# EAGLE schematic loa_v2c (EAGLE 6.5.0)

## Sheet 1 of 7
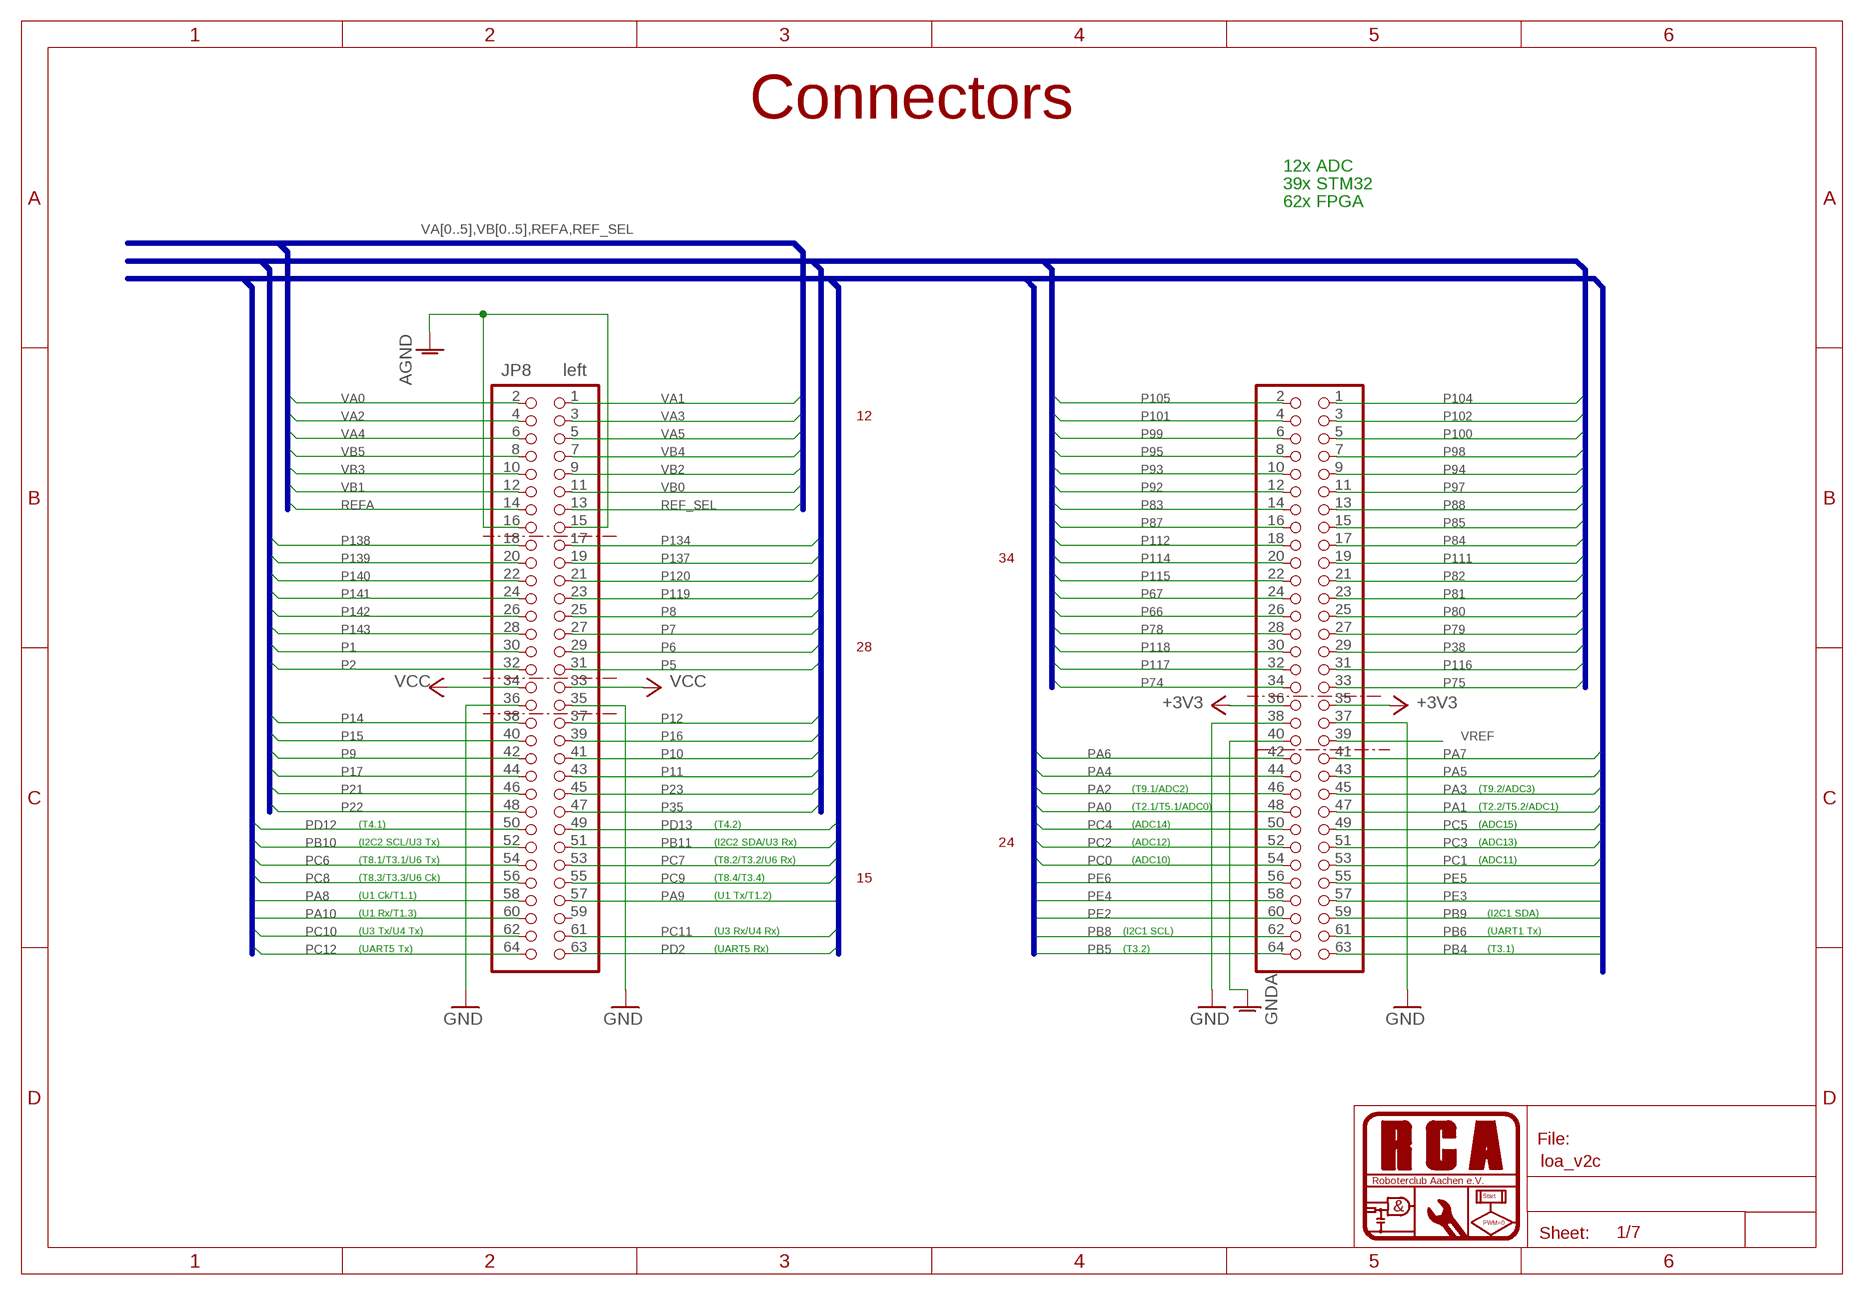
[diagram p0: schematic, sheet 1]

### Parts
JP7  right  PINHD-2X32_2.00-SMD  [2X32M_SMD]
JP8  left  PINHD-2X32_2.00-SMD  [2X32M_SMD]

### Nets
+3V3: JP7.35 JP7.36 ; also sheet 2,3,4,5,6,7
AGND: JP8.15 JP8.16 ; also sheet 4
GND: JP7.37 JP7.38 JP8.35 JP8.36 ; also sheet 2,3,4,5,6,7
GNDA: JP7.40 ; also sheet 7
P1: JP8.30 ; also sheet 3
P2: JP8.32 ; also sheet 3
P5: JP8.31 ; also sheet 3
P6: JP8.29 ; also sheet 3
P7: JP8.27 ; also sheet 3
P8: JP8.25 ; also sheet 3
P9: JP8.42 ; also sheet 3
P10: JP8.41 ; also sheet 3
P11: JP8.43 ; also sheet 3
P12: JP8.37 ; also sheet 3
P14: JP8.38 ; also sheet 3
P15: JP8.40 ; also sheet 3
P16: JP8.39 ; also sheet 3
P17: JP8.44 ; also sheet 3
P21: JP8.46 ; also sheet 3
P22: JP8.48 ; also sheet 3
P23: JP8.45 ; also sheet 3
P35: JP8.47 ; also sheet 3
P38: JP7.29 ; also sheet 3
P66: JP7.26 ; also sheet 3
P67: JP7.24 ; also sheet 3
P74: JP7.34 ; also sheet 3
P75: JP7.33 ; also sheet 3
P78: JP7.28 ; also sheet 3
P79: JP7.27 ; also sheet 3
P80: JP7.25 ; also sheet 3
P81: JP7.23 ; also sheet 3
P82: JP7.21 ; also sheet 3
P83: JP7.14 ; also sheet 3
P84: JP7.17 ; also sheet 3
P85: JP7.15 ; also sheet 3
P87: JP7.16 ; also sheet 3
P88: JP7.13 ; also sheet 3
P92: JP7.12 ; also sheet 3
P93: JP7.10 ; also sheet 3
P94: JP7.9 ; also sheet 3
P95: JP7.8 ; also sheet 3
P97: JP7.11 ; also sheet 3
P98: JP7.7 ; also sheet 3
P99: JP7.6 ; also sheet 3
P100: JP7.5 ; also sheet 3
P101: JP7.4 ; also sheet 3
P102: JP7.3 ; also sheet 3
P104: JP7.1 ; also sheet 3
P105: JP7.2 ; also sheet 3
P111: JP7.19 ; also sheet 3
P112: JP7.18 ; also sheet 3
P114: JP7.20 ; also sheet 3
P115: JP7.22 ; also sheet 3
P116: JP7.31 ; also sheet 3
P117: JP7.32 ; also sheet 3
P118: JP7.30 ; also sheet 3
P119: JP8.23 ; also sheet 3
P120: JP8.21 ; also sheet 3
P134: JP8.17 ; also sheet 3
P137: JP8.19 ; also sheet 3
P138: JP8.18 ; also sheet 3
P139: JP8.20 ; also sheet 3
P140: JP8.22 ; also sheet 3
P141: JP8.24 ; also sheet 3
P142: JP8.26 ; also sheet 3
P143: JP8.28 ; also sheet 3
PA0: JP7.48 ; also sheet 2
PA1: JP7.47 ; also sheet 2
PA2: JP7.46 ; also sheet 2
PA3: JP7.45 ; also sheet 2
PA4: JP7.44 ; also sheet 2
PA5: JP7.43 ; also sheet 2
PA6: JP7.42 ; also sheet 2
PA7: JP7.41 ; also sheet 2
PA8: JP8.58 ; also sheet 2
PA9: JP8.57 ; also sheet 2
PA10: JP8.60 ; also sheet 2
PB4: JP7.63 ; also sheet 2
PB5: JP7.64 ; also sheet 2
PB6: JP7.61 ; also sheet 2
PB8: JP7.62 ; also sheet 2
PB9: JP7.59 ; also sheet 2
PB10: JP8.52 ; also sheet 2
PB11: JP8.51 ; also sheet 2
PC0: JP7.54 ; also sheet 2
PC1: JP7.53 ; also sheet 2
PC2: JP7.52 ; also sheet 2
PC3: JP7.51 ; also sheet 2
PC4: JP7.50 ; also sheet 2
PC5: JP7.49 ; also sheet 2
PC6: JP8.54 ; also sheet 2
PC7: JP8.53 ; also sheet 2
PC8: JP8.56 ; also sheet 2
PC9: JP8.55 ; also sheet 2
PC10: JP8.62 ; also sheet 2
PC11: JP8.61 ; also sheet 2
PC12: JP8.64 ; also sheet 2
PD2: JP8.63 ; also sheet 2
PD12: JP8.50 ; also sheet 2
PD13: JP8.49 ; also sheet 2
PE2: JP7.60 ; also sheet 2
PE3: JP7.57 ; also sheet 2
PE4: JP7.58 ; also sheet 2
PE5: JP7.55 ; also sheet 2,5
PE6: JP7.56 ; also sheet 2,5
REF_SEL: JP8.13 ; also sheet 4
REFA: JP8.14 ; also sheet 4
VA0: JP8.2 ; also sheet 4
VA1: JP8.1 ; also sheet 4
VA2: JP8.4 ; also sheet 4
VA3: JP8.3 ; also sheet 4
VA4: JP8.6 ; also sheet 4
VA5: JP8.5 ; also sheet 4
VB0: JP8.11 ; also sheet 4
VB1: JP8.12 ; also sheet 4
VB2: JP8.9 ; also sheet 4
VB3: JP8.10 ; also sheet 4
VB4: JP8.7 ; also sheet 4
VB5: JP8.8 ; also sheet 4
VCC: JP8.33 JP8.34 ; also sheet 6
VREF: JP7.39 ; also sheet 7
Unconnected: JP8.59

### Buses
VA[0..5],VB[0..5],REFA,REF_SEL
P[1..2],P[5..12],P[14..17],P[21..24],P[26..27],P[29..30],P[32..35],P38,P66,P67,P74,P75,P[78..85],P87,P88,P[92..95],P[97..102],P104,P105,P[111..112],P[114..121],P[123..124],P[126..127],P[131..134],P[137..143]
PA[0..10],PB[0..2],PB[4..6],PB[8..11],PC[0..12],PD2,PD[12..13],PE[2..6]

### Notes on the sheet
- Connectors
- 12x ADC
- 39x STM32
- 62x FPGA
- 12
- 34
- 28
- (T9.1/ADC2) | (T9.2/ADC3)
- (T2.1/T5.1/ADC0) | (T2.2/T5.2/ADC1)
- (T4.1) | (T4.2) | (ADC14) | (ADC15)
- (I2C2 SCL/U3 Tx) | (I2C2 SDA/U3 Rx) | 24 | (ADC12) | (ADC13)
- (T8.1/T3.1/U6 Tx) | (T8.2/T3.2/U6 Rx) | (ADC10) | (ADC11)
- (T8.3/T3.3/U6 Ck) | (T8.4/T3.4) | 15
- (U1 Ck/T1.1) | (U1 Tx/T1.2)
- (U1 Rx/T1.3) | (I2C1 SDA)
- (U3 Tx/U4 Tx) | (U3 Rx/U4 Rx) | (I2C1 SCL) | (UART1 Tx)
- (UART5 Tx) | (UART5 Rx) | (T3.2) | (T3.1)

## Sheet 2 of 7
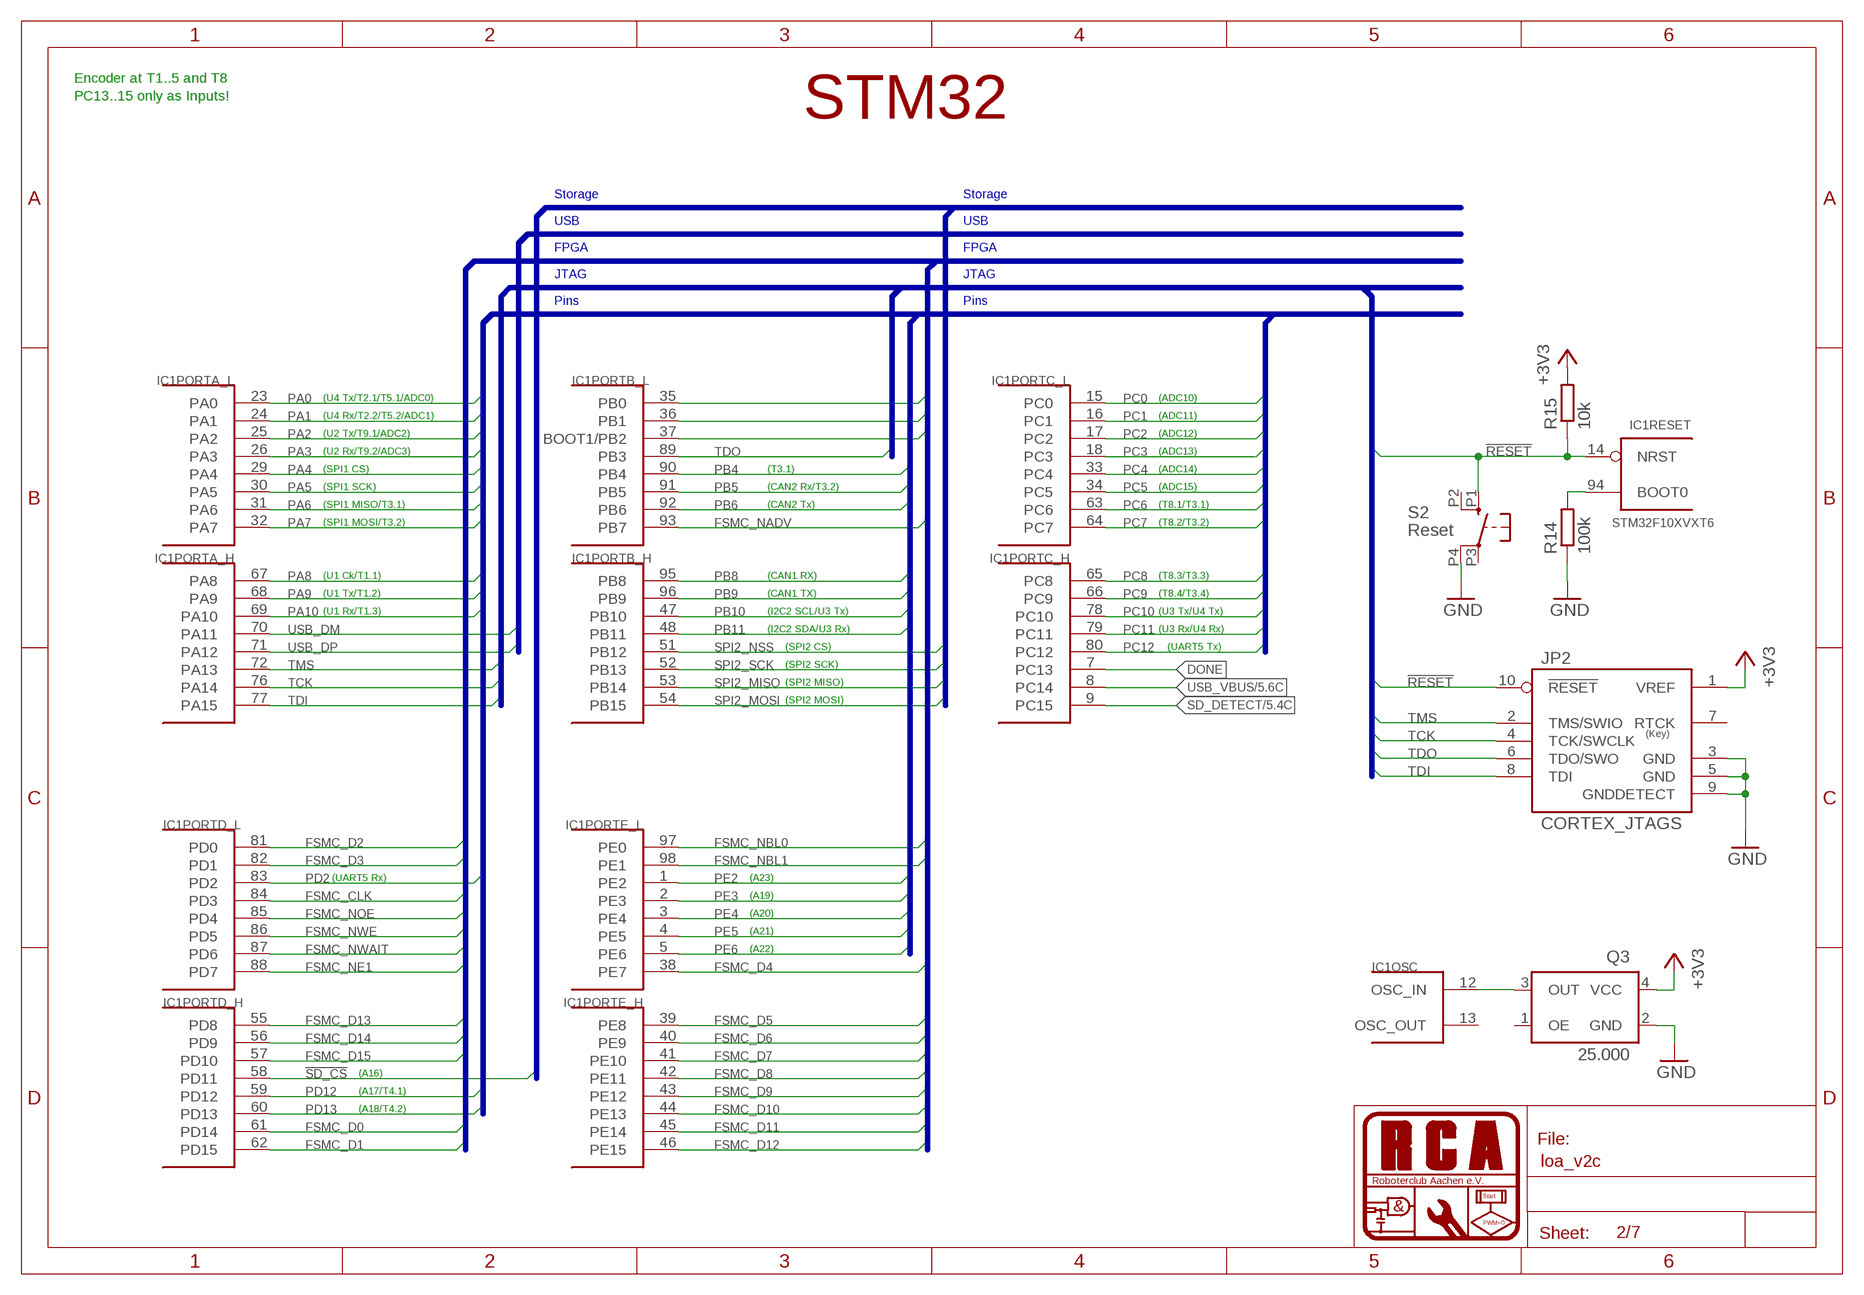
[diagram p1: schematic, sheet 2]

### Parts
IC1  STM32F10XVXT6  [TQFP100]
JP2  CORTEX_JTAGS  [2X05SMD]
Q3  25.000  XO53  [XO53]
R14  100k  R-EU_R0603  [R0603]
R15  10k  R-EU_R0603  [R0603]
S2  Reset  10-XXLSH  [B3F-10XX-SMD]

### Nets
!RESET: IC1.14(RESET:NRST) JP2.10(!RESET) R15.1 S2.P1(S)
!SD_CS: IC1.58(PORTD_H:PD11) ; also sheet 5
+3V3: JP2.1(VREF) Q3.4(VCC) R15.2 ; also sheet 1,3,4,5,6,7
CCLK: IC1.35(PORTB_L:PB0) ; also sheet 3
DONE: IC1.7(PORTC_H:PC13) ; also sheet 3
FSMC_CLK: IC1.84(PORTD_L:PD3) ; also sheet 3
FSMC_D0: IC1.61(PORTD_H:PD14) ; also sheet 3
FSMC_D1: IC1.62(PORTD_H:PD15) ; also sheet 3
FSMC_D2: IC1.81(PORTD_L:PD0) ; also sheet 3
FSMC_D3: IC1.82(PORTD_L:PD1) ; also sheet 3
FSMC_D4: IC1.38(PORTE_L:PE7) ; also sheet 3
FSMC_D5: IC1.39(PORTE_H:PE8) ; also sheet 3
FSMC_D6: IC1.40(PORTE_H:PE9) ; also sheet 3
FSMC_D7: IC1.41(PORTE_H:PE10) ; also sheet 3
FSMC_D8: IC1.42(PORTE_H:PE11) ; also sheet 3
FSMC_D9: IC1.43(PORTE_H:PE12) ; also sheet 3
FSMC_D10: IC1.44(PORTE_H:PE13) ; also sheet 3
FSMC_D11: IC1.45(PORTE_H:PE14) ; also sheet 3
FSMC_D12: IC1.46(PORTE_H:PE15) ; also sheet 3
FSMC_D13: IC1.55(PORTD_H:PD8) ; also sheet 3
FSMC_D14: IC1.56(PORTD_H:PD9) ; also sheet 3
FSMC_D15: IC1.57(PORTD_H:PD10) ; also sheet 3
FSMC_NADV: IC1.93(PORTB_L:PB7) ; also sheet 3
FSMC_NBL0: IC1.97(PORTE_L:PE0) ; also sheet 3
FSMC_NBL1: IC1.98(PORTE_L:PE1) ; also sheet 3
FSMC_NE1: IC1.88(PORTD_L:PD7) ; also sheet 3
FSMC_NOE: IC1.85(PORTD_L:PD4) ; also sheet 3
FSMC_NWAIT: IC1.87(PORTD_L:PD6) ; also sheet 3
FSMC_NWE: IC1.86(PORTD_L:PD5) ; also sheet 3
GND: JP2.3(GND) JP2.5(GND) JP2.9(GNDDETECT) Q3.2(GND) R14.1 S2.P4(P1) ; also sheet 1,3,4,5,6,7
INIT_B: IC1.36(PORTB_L:PB1) ; also sheet 3
N$41: IC1.94(RESET:BOOT0) R14.2
N$56: IC1.12(OSC:OSC_IN) Q3.3(OUT)
PA0: IC1.23(PORTA_L:PA0) ; also sheet 1
PA1: IC1.24(PORTA_L:PA1) ; also sheet 1
PA2: IC1.25(PORTA_L:PA2) ; also sheet 1
PA3: IC1.26(PORTA_L:PA3) ; also sheet 1
PA4: IC1.29(PORTA_L:PA4) ; also sheet 1
PA5: IC1.30(PORTA_L:PA5) ; also sheet 1
PA6: IC1.31(PORTA_L:PA6) ; also sheet 1
PA7: IC1.32(PORTA_L:PA7) ; also sheet 1
PA8: IC1.67(PORTA_H:PA8) ; also sheet 1
PA9: IC1.68(PORTA_H:PA9) ; also sheet 1
PA10: IC1.69(PORTA_H:PA10) ; also sheet 1
PB4: IC1.90(PORTB_L:PB4) ; also sheet 1
PB5: IC1.91(PORTB_L:PB5) ; also sheet 1
PB6: IC1.92(PORTB_L:PB6) ; also sheet 1
PB8: IC1.95(PORTB_H:PB8) ; also sheet 1
PB9: IC1.96(PORTB_H:PB9) ; also sheet 1
PB10: IC1.47(PORTB_H:PB10) ; also sheet 1
PB11: IC1.48(PORTB_H:PB11) ; also sheet 1
PC0: IC1.15(PORTC_L:PC0) ; also sheet 1
PC1: IC1.16(PORTC_L:PC1) ; also sheet 1
PC2: IC1.17(PORTC_L:PC2) ; also sheet 1
PC3: IC1.18(PORTC_L:PC3) ; also sheet 1
PC4: IC1.33(PORTC_L:PC4) ; also sheet 1
PC5: IC1.34(PORTC_L:PC5) ; also sheet 1
PC6: IC1.63(PORTC_L:PC6) ; also sheet 1
PC7: IC1.64(PORTC_L:PC7) ; also sheet 1
PC8: IC1.65(PORTC_H:PC8) ; also sheet 1
PC9: IC1.66(PORTC_H:PC9) ; also sheet 1
PC10: IC1.78(PORTC_H:PC10) ; also sheet 1
PC11: IC1.79(PORTC_H:PC11) ; also sheet 1
PC12: IC1.80(PORTC_H:PC12) ; also sheet 1
PD2: IC1.83(PORTD_L:PD2) ; also sheet 1
PD12: IC1.59(PORTD_H:PD12) ; also sheet 1
PD13: IC1.60(PORTD_H:PD13) ; also sheet 1
PE2: IC1.1(PORTE_L:PE2) ; also sheet 1
PE3: IC1.2(PORTE_L:PE3) ; also sheet 1
PE4: IC1.3(PORTE_L:PE4) ; also sheet 1
PE5: IC1.4(PORTE_L:PE5) ; also sheet 1,5
PE6: IC1.5(PORTE_L:PE6) ; also sheet 1,5
PROGRAM_B: IC1.37(PORTB_L:BOOT1/PB2) ; also sheet 3
SD_DETECT: IC1.9(PORTC_H:PC15) ; also sheet 5
SPI2_MISO: IC1.53(PORTB_H:PB14) ; also sheet 5
SPI2_MOSI: IC1.54(PORTB_H:PB15) ; also sheet 5
SPI2_NSS: IC1.51(PORTB_H:PB12) ; also sheet 5
SPI2_SCK: IC1.52(PORTB_H:PB13) ; also sheet 5
TCK: IC1.76(PORTA_H:PA14) JP2.4(TCK/SWCLK)
TDI: IC1.77(PORTA_H:PA15) JP2.8(TDI)
TDO: IC1.89(PORTB_L:PB3) JP2.6(TDO/SWO)
TMS: IC1.72(PORTA_H:PA13) JP2.2(TMS/SWIO)
USB_DM: IC1.70(PORTA_H:PA11) ; also sheet 5
USB_DP: IC1.71(PORTA_H:PA12) ; also sheet 5
USB_VBUS: IC1.8(PORTC_H:PC14) ; also sheet 5,6
Unconnected: IC1.13(OSC:OSC_OUT) JP2.7(RTCK) Q3.1(OE) S2.P2(S1) S2.P3(P)

### Buses
JTAG:!RESET,TRST,TMS,TCK,TDO,TDI
USB:USB_VBUS,USB_DM,USB_DP
PA[0..10],PB[0..2],PB[4..6],PB[8..11],PC[0..12],PD2,PD[12..13],PE[2..6]
FPGA:FSMC_D[0..15],FSMC_NADV,FSMC_CLK,FSMC_NOE,FSMC_NWE,FSMC_NWAIT,FSMC_NE1,FSMC_NBL0,FSMC_NBL1,PROGRAM_B,INIT_B,DONE,CCLK
STORAGE:SPI2_NSS,SPI2_SCK,SPI2_MOSI,SPI2_MISO,SD_DETECT,!SD_CS

### Notes on the sheet
- Encoder at T1..5 and T8
- PC13..15 only as Inputs!
- STM32
- Storage | Storage
- USB | USB
- FPGA | FPGA
- JTAG | JTAG
- Pins | Pins
- (U4 Tx/T2.1/T5.1/ADC0) | (ADC10)
- (U4 Rx/T2.2/T5.2/ADC1) | (ADC11)
- (U2 Tx/T9.1/ADC2) | (ADC12)
- (U2 Rx/T9.2/ADC3) | (ADC13)
- (SPI1 CS) | (T3.1) | (ADC14)
- (SPI1 SCK) | (CAN2 Rx/T3.2) | (ADC15)
- (SPI1 MISO/T3.1) | (CAN2 Tx) | (T8.1/T3.1)
- (SPI1 MOSI/T3.2) | (T8.2/T3.2)
- (U1 Ck/T1.1) | (CAN1 RX) | (T8.3/T3.3)
- (U1 Tx/T1.2) | (CAN1 TX) | (T8.4/T3.4)
- (U1 Rx/T1.3) | (I2C2 SCL/U3 Tx) | (U3 Tx/U4 Tx)
- (I2C2 SDA/U3 Rx) | (U3 Rx/U4 Rx)
- (SPI2 CS) | (UART5 Tx)
- (SPI2 SCK)
- (SPI2 MISO)
- (SPI2 MOSI)
- (UART5 Rx) | (A23)
- (A19)
- (A20)
- (A21)
- (A22)
- (A16)
- (A17/T4.1)
- (A18/T4.2)

## Sheet 3 of 7
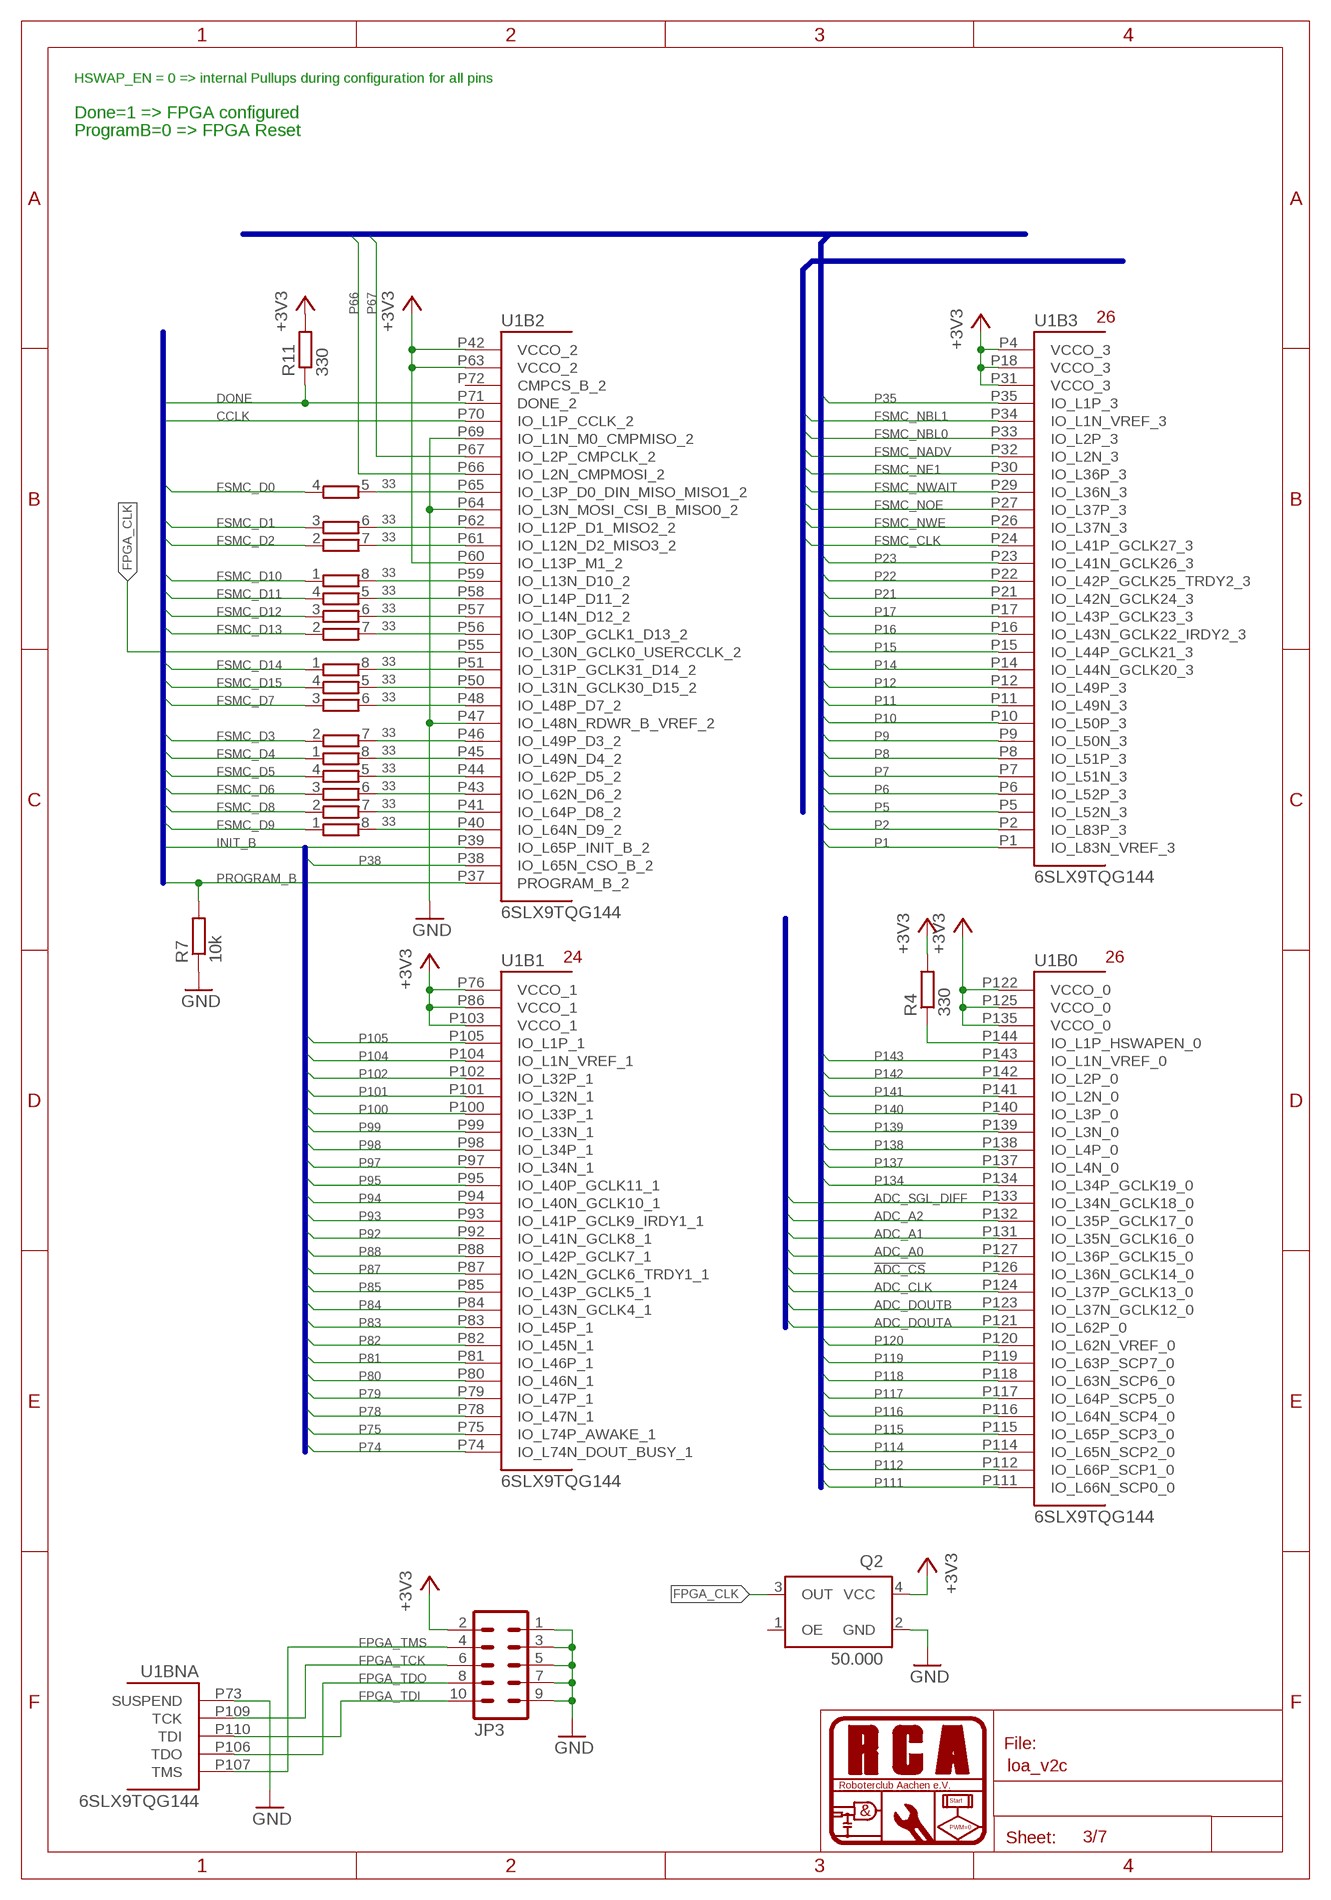
[diagram p2: schematic, sheet 3]

### Parts
JP3  ML10S  [ML10S]
Q2  50.000  XO53  [XO53]
R4  330  R-EU_R0603  [R0603]
R7  10k  R-EU_R0603  [R0603]
R11  330  R-EU_R0603  [R0603]
RN3  33  4R-NEXB38V  [EXB38V]
RN4  33  4R-NEXB38V  [EXB38V]
RN6  33  4R-NEXB38V  [EXB38V]
RN7  33  4R-NEXB38V  [EXB38V]
U1  6SLX9TQG144  [TQ144]

### Nets
!ADC_CS: U1.P126(B0:IO_L36N_GCLK14_0) ; also sheet 4
+3V3: JP3.2 Q2.4(VCC) R4.2 R11.2 U1.P4(B3:VCCO_3) U1.P18(B3:VCCO_3) U1.P31(B3:VCCO_3) U1.P42(B2:VCCO_2) U1.P60(B2:IO_L13P_M1_2) U1.P63(B2:VCCO_2) U1.P76(B1:VCCO_1) U1.P86(B1:VCCO_1) U1.P103(B1:VCCO_1) U1.P122(B0:VCCO_0) U1.P125(B0:VCCO_0) U1.P135(B0:VCCO_0) ; also sheet 1,2,4,5,6,7
ADC_A0: U1.P127(B0:IO_L36P_GCLK15_0) ; also sheet 4
ADC_A1: U1.P131(B0:IO_L35N_GCLK16_0) ; also sheet 4
ADC_A2: U1.P132(B0:IO_L35P_GCLK17_0) ; also sheet 4
ADC_CLK: U1.P124(B0:IO_L37P_GCLK13_0) ; also sheet 4
ADC_DOUTA: U1.P121(B0:IO_L62P_0) ; also sheet 4
ADC_DOUTB: U1.P123(B0:IO_L37N_GCLK12_0) ; also sheet 4
ADC_SGL_DIFF: U1.P133(B0:IO_L34N_GCLK18_0) ; also sheet 4
CCLK: U1.P70(B2:IO_L1P_CCLK_2) ; also sheet 2
DONE: R11.1 U1.P71(B2:DONE_2) ; also sheet 2
FPGA_CLK: Q2.3(OUT) U1.P55(B2:IO_L30N_GCLK0_USERCCLK_2)
FPGA_TCK: JP3.6 U1.P109(BNA:TCK)
FPGA_TDI: JP3.10 U1.P110(BNA:TDI)
FPGA_TDO: JP3.8 U1.P106(BNA:TDO)
FPGA_TMS: JP3.4 U1.P107(BNA:TMS)
FSMC_CLK: U1.P24(B3:IO_L41P_GCLK27_3) ; also sheet 2
FSMC_D0: RN3.4 ; also sheet 2
FSMC_D1: RN3.3 ; also sheet 2
FSMC_D2: RN3.2 ; also sheet 2
FSMC_D3: RN7.2 ; also sheet 2
FSMC_D4: RN7.1 ; also sheet 2
FSMC_D5: RN4.4 ; also sheet 2
FSMC_D6: RN4.3 ; also sheet 2
FSMC_D7: RN7.3 ; also sheet 2
FSMC_D8: RN4.2 ; also sheet 2
FSMC_D9: RN4.1 ; also sheet 2
FSMC_D10: RN3.1 ; also sheet 2
FSMC_D11: RN6.4 ; also sheet 2
FSMC_D12: RN6.3 ; also sheet 2
FSMC_D13: RN6.2 ; also sheet 2
FSMC_D14: RN6.1 ; also sheet 2
FSMC_D15: RN7.4 ; also sheet 2
FSMC_NADV: U1.P32(B3:IO_L2N_3) ; also sheet 2
FSMC_NBL0: U1.P33(B3:IO_L2P_3) ; also sheet 2
FSMC_NBL1: U1.P34(B3:IO_L1N_VREF_3) ; also sheet 2
FSMC_NE1: U1.P30(B3:IO_L36P_3) ; also sheet 2
FSMC_NOE: U1.P27(B3:IO_L37P_3) ; also sheet 2
FSMC_NWAIT: U1.P29(B3:IO_L36N_3) ; also sheet 2
FSMC_NWE: U1.P26(B3:IO_L37N_3) ; also sheet 2
GND: JP3.1 JP3.3 JP3.5 JP3.7 JP3.9 Q2.2(GND) R7.1 U1.P47(B2:IO_L48N_RDWR_B_VREF_2) U1.P64(B2:IO_L3N_MOSI_CSI_B_MISO0_2) U1.P69(B2:IO_L1N_M0_CMPMISO_2) U1.P73(BNA:SUSPEND) ; also sheet 1,2,4,5,6,7
INIT_B: U1.P39(B2:IO_L65P_INIT_B_2) ; also sheet 2
N$2: RN3.5 U1.P65(B2:IO_L3P_D0_DIN_MISO_MISO1_2)
N$3: RN3.6 U1.P62(B2:IO_L12P_D1_MISO2_2)
N$5: RN3.7 U1.P61(B2:IO_L12N_D2_MISO3_2)
N$6: RN3.8 U1.P59(B2:IO_L13N_D10_2)
N$7: RN6.5 U1.P58(B2:IO_L14P_D11_2)
N$8: RN6.6 U1.P57(B2:IO_L14N_D12_2)
N$9: RN6.7 U1.P56(B2:IO_L30P_GCLK1_D13_2)
N$10: RN6.8 U1.P51(B2:IO_L31P_GCLK31_D14_2)
N$11: RN7.5 U1.P50(B2:IO_L31N_GCLK30_D15_2)
N$12: RN7.6 U1.P48(B2:IO_L48P_D7_2)
N$13: RN7.7 U1.P46(B2:IO_L49P_D3_2)
N$14: RN7.8 U1.P45(B2:IO_L49N_D4_2)
N$15: RN4.5 U1.P44(B2:IO_L62P_D5_2)
N$20: R4.1 U1.P144(B0:IO_L1P_HSWAPEN_0)
N$35: RN4.7 U1.P41(B2:IO_L64P_D8_2)
N$44: RN4.6 U1.P43(B2:IO_L62N_D6_2)
N$45: RN4.8 U1.P40(B2:IO_L64N_D9_2)
P1: U1.P1(B3:IO_L83N_VREF_3) ; also sheet 1
P2: U1.P2(B3:IO_L83P_3) ; also sheet 1
P5: U1.P5(B3:IO_L52N_3) ; also sheet 1
P6: U1.P6(B3:IO_L52P_3) ; also sheet 1
P7: U1.P7(B3:IO_L51N_3) ; also sheet 1
P8: U1.P8(B3:IO_L51P_3) ; also sheet 1
P9: U1.P9(B3:IO_L50N_3) ; also sheet 1
P10: U1.P10(B3:IO_L50P_3) ; also sheet 1
P11: U1.P11(B3:IO_L49N_3) ; also sheet 1
P12: U1.P12(B3:IO_L49P_3) ; also sheet 1
P14: U1.P14(B3:IO_L44N_GCLK20_3) ; also sheet 1
P15: U1.P15(B3:IO_L44P_GCLK21_3) ; also sheet 1
P16: U1.P16(B3:IO_L43N_GCLK22_IRDY2_3) ; also sheet 1
P17: U1.P17(B3:IO_L43P_GCLK23_3) ; also sheet 1
P21: U1.P21(B3:IO_L42N_GCLK24_3) ; also sheet 1
P22: U1.P22(B3:IO_L42P_GCLK25_TRDY2_3) ; also sheet 1
P23: U1.P23(B3:IO_L41N_GCLK26_3) ; also sheet 1
P35: U1.P35(B3:IO_L1P_3) ; also sheet 1
P38: U1.P38(B2:IO_L65N_CSO_B_2) ; also sheet 1
P66: U1.P66(B2:IO_L2N_CMPMOSI_2) ; also sheet 1
P67: U1.P67(B2:IO_L2P_CMPCLK_2) ; also sheet 1
P74: U1.P74(B1:IO_L74N_DOUT_BUSY_1) ; also sheet 1
P75: U1.P75(B1:IO_L74P_AWAKE_1) ; also sheet 1
P78: U1.P78(B1:IO_L47N_1) ; also sheet 1
P79: U1.P79(B1:IO_L47P_1) ; also sheet 1
P80: U1.P80(B1:IO_L46N_1) ; also sheet 1
P81: U1.P81(B1:IO_L46P_1) ; also sheet 1
P82: U1.P82(B1:IO_L45N_1) ; also sheet 1
P83: U1.P83(B1:IO_L45P_1) ; also sheet 1
P84: U1.P84(B1:IO_L43N_GCLK4_1) ; also sheet 1
P85: U1.P85(B1:IO_L43P_GCLK5_1) ; also sheet 1
P87: U1.P87(B1:IO_L42N_GCLK6_TRDY1_1) ; also sheet 1
P88: U1.P88(B1:IO_L42P_GCLK7_1) ; also sheet 1
P92: U1.P92(B1:IO_L41N_GCLK8_1) ; also sheet 1
P93: U1.P93(B1:IO_L41P_GCLK9_IRDY1_1) ; also sheet 1
P94: U1.P94(B1:IO_L40N_GCLK10_1) ; also sheet 1
P95: U1.P95(B1:IO_L40P_GCLK11_1) ; also sheet 1
P97: U1.P97(B1:IO_L34N_1) ; also sheet 1
P98: U1.P98(B1:IO_L34P_1) ; also sheet 1
P99: U1.P99(B1:IO_L33N_1) ; also sheet 1
P100: U1.P100(B1:IO_L33P_1) ; also sheet 1
P101: U1.P101(B1:IO_L32N_1) ; also sheet 1
P102: U1.P102(B1:IO_L32P_1) ; also sheet 1
P104: U1.P104(B1:IO_L1N_VREF_1) ; also sheet 1
P105: U1.P105(B1:IO_L1P_1) ; also sheet 1
P111: U1.P111(B0:IO_L66N_SCP0_0) ; also sheet 1
P112: U1.P112(B0:IO_L66P_SCP1_0) ; also sheet 1
P114: U1.P114(B0:IO_L65N_SCP2_0) ; also sheet 1
P115: U1.P115(B0:IO_L65P_SCP3_0) ; also sheet 1
P116: U1.P116(B0:IO_L64N_SCP4_0) ; also sheet 1
P117: U1.P117(B0:IO_L64P_SCP5_0) ; also sheet 1
P118: U1.P118(B0:IO_L63N_SCP6_0) ; also sheet 1
P119: U1.P119(B0:IO_L63P_SCP7_0) ; also sheet 1
P120: U1.P120(B0:IO_L62N_VREF_0) ; also sheet 1
P134: U1.P134(B0:IO_L34P_GCLK19_0) ; also sheet 1
P137: U1.P137(B0:IO_L4N_0) ; also sheet 1
P138: U1.P138(B0:IO_L4P_0) ; also sheet 1
P139: U1.P139(B0:IO_L3N_0) ; also sheet 1
P140: U1.P140(B0:IO_L3P_0) ; also sheet 1
P141: U1.P141(B0:IO_L2N_0) ; also sheet 1
P142: U1.P142(B0:IO_L2P_0) ; also sheet 1
P143: U1.P143(B0:IO_L1N_VREF_0) ; also sheet 1
PROGRAM_B: R7.2 U1.P37(B2:PROGRAM_B_2) ; also sheet 2
Unconnected: Q2.1(OE) U1.P72(B2:CMPCS_B_2)

### Buses
FPGA:FSMC_D[0..15],FSMC_NADV,FSMC_CLK,FSMC_NOE,FSMC_NWE,FSMC_NWAIT,FSMC_NE1,FSMC_NBL0,FSMC_NBL1,PROGRAM_B,INIT_B,DONE,CCLK
ADC:!ADC_CS,ADC_CLK,ADC_DOUTA,ADC_DOUTB,ADC_A[0..2],ADC_SGL_DIFF
P[1..2],P[5..12],P[14..17],P[21..24],P[26..27],P[29..30],P[32..35],P38,P66,P67,P74,P75,P[78..85],P87,P88,P[92..95],P[97..102],P104,P105,P[111..112],P[114..121],P[123..124],P[126..127],P[131..134],P[137..143]

### Notes on the sheet
- HSWAP_EN = 0 => internal Pullups during configuration for all pins
- Done=1 => FPGA configured
- ProgramB=0 => FPGA Reset
- 26
- 24 | 26

## Sheet 4 of 7
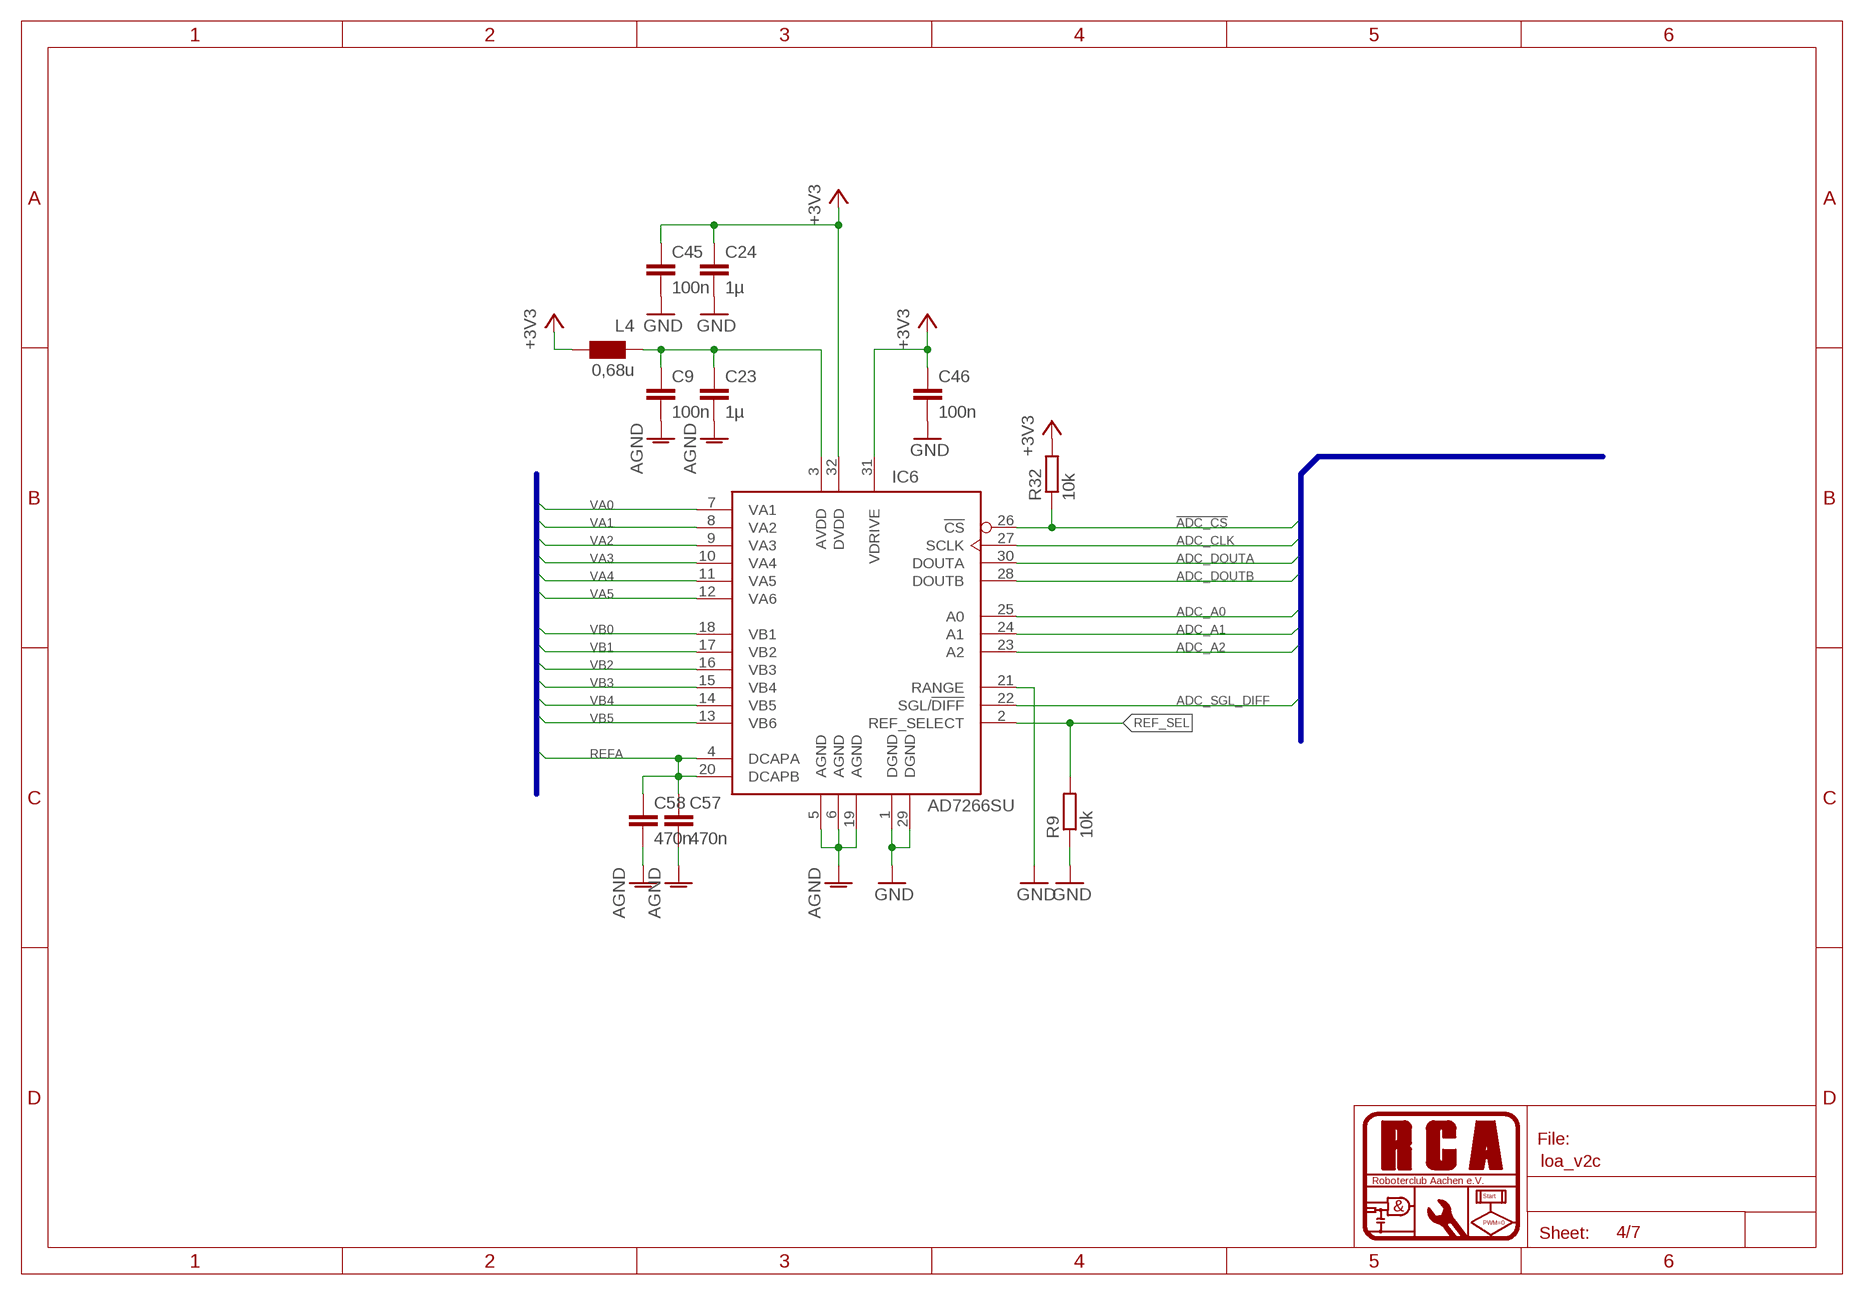
[diagram p3: schematic, sheet 4]

### Parts
C9  100n  C-EUC0603  [C0603]
C23  1µ  C-EUC0805  [C0805]
C24  1µ  C-EUC0805  [C0805]
C45  100n  C-EUC0603  [C0603]
C46  100n  C-EUC0603  [C0603]
C57  470n  C-EUC0805  [C0805]
C58  470n  C-EUC0805  [C0805]
IC6  AD7266SU  [TQFP32-08]
L4  0,68u  WE-KIHQ_0805  [WE-KI_0805_B]
R9  10k  R-EU_R0603  [R0603]
R32  10k  R-EU_R0603  [R0603]

### Nets
!ADC_CS: IC6.26(!CS) R32.1 ; also sheet 3
+3V3: C24.1 C45.1 C46.1 IC6.31(VDRIVE) IC6.32(DVDD) L4.1 R32.2 ; also sheet 1,2,3,5,6,7
ADC_A0: IC6.25(A0) ; also sheet 3
ADC_A1: IC6.24(A1) ; also sheet 3
ADC_A2: IC6.23(A2) ; also sheet 3
ADC_CLK: IC6.27(SCLK) ; also sheet 3
ADC_DOUTA: IC6.30(DOUTA) ; also sheet 3
ADC_DOUTB: IC6.28(DOUTB) ; also sheet 3
ADC_SGL_DIFF: IC6.22(SGL/!DIFF) ; also sheet 3
AGND: C9.2 C23.2 C57.2 C58.2 IC6.5(AGND) IC6.6(AGND) IC6.19(AGND) ; also sheet 1
GND: C24.2 C45.2 C46.2 IC6.1(DGND) IC6.21(RANGE) IC6.29(DGND) R9.1 ; also sheet 1,2,3,5,6,7
N$55: C9.1 C23.1 IC6.3(AVDD) L4.2
REF_SEL: IC6.2(REF_SELECT) R9.2 ; also sheet 1
REFA: C57.1 C58.1 IC6.4(DCAPA) IC6.20(DCAPB) ; also sheet 1
VA0: IC6.7(VA1) ; also sheet 1
VA1: IC6.8(VA2) ; also sheet 1
VA2: IC6.9(VA3) ; also sheet 1
VA3: IC6.10(VA4) ; also sheet 1
VA4: IC6.11(VA5) ; also sheet 1
VA5: IC6.12(VA6) ; also sheet 1
VB0: IC6.18(VB1) ; also sheet 1
VB1: IC6.17(VB2) ; also sheet 1
VB2: IC6.16(VB3) ; also sheet 1
VB3: IC6.15(VB4) ; also sheet 1
VB4: IC6.14(VB5) ; also sheet 1
VB5: IC6.13(VB6) ; also sheet 1

### Buses
VA[0..5],VB[0..5],REFA,REF_SEL
ADC:!ADC_CS,ADC_CLK,ADC_DOUTA,ADC_DOUTB,ADC_A[0..2],ADC_SGL_DIFF

## Sheet 5 of 7
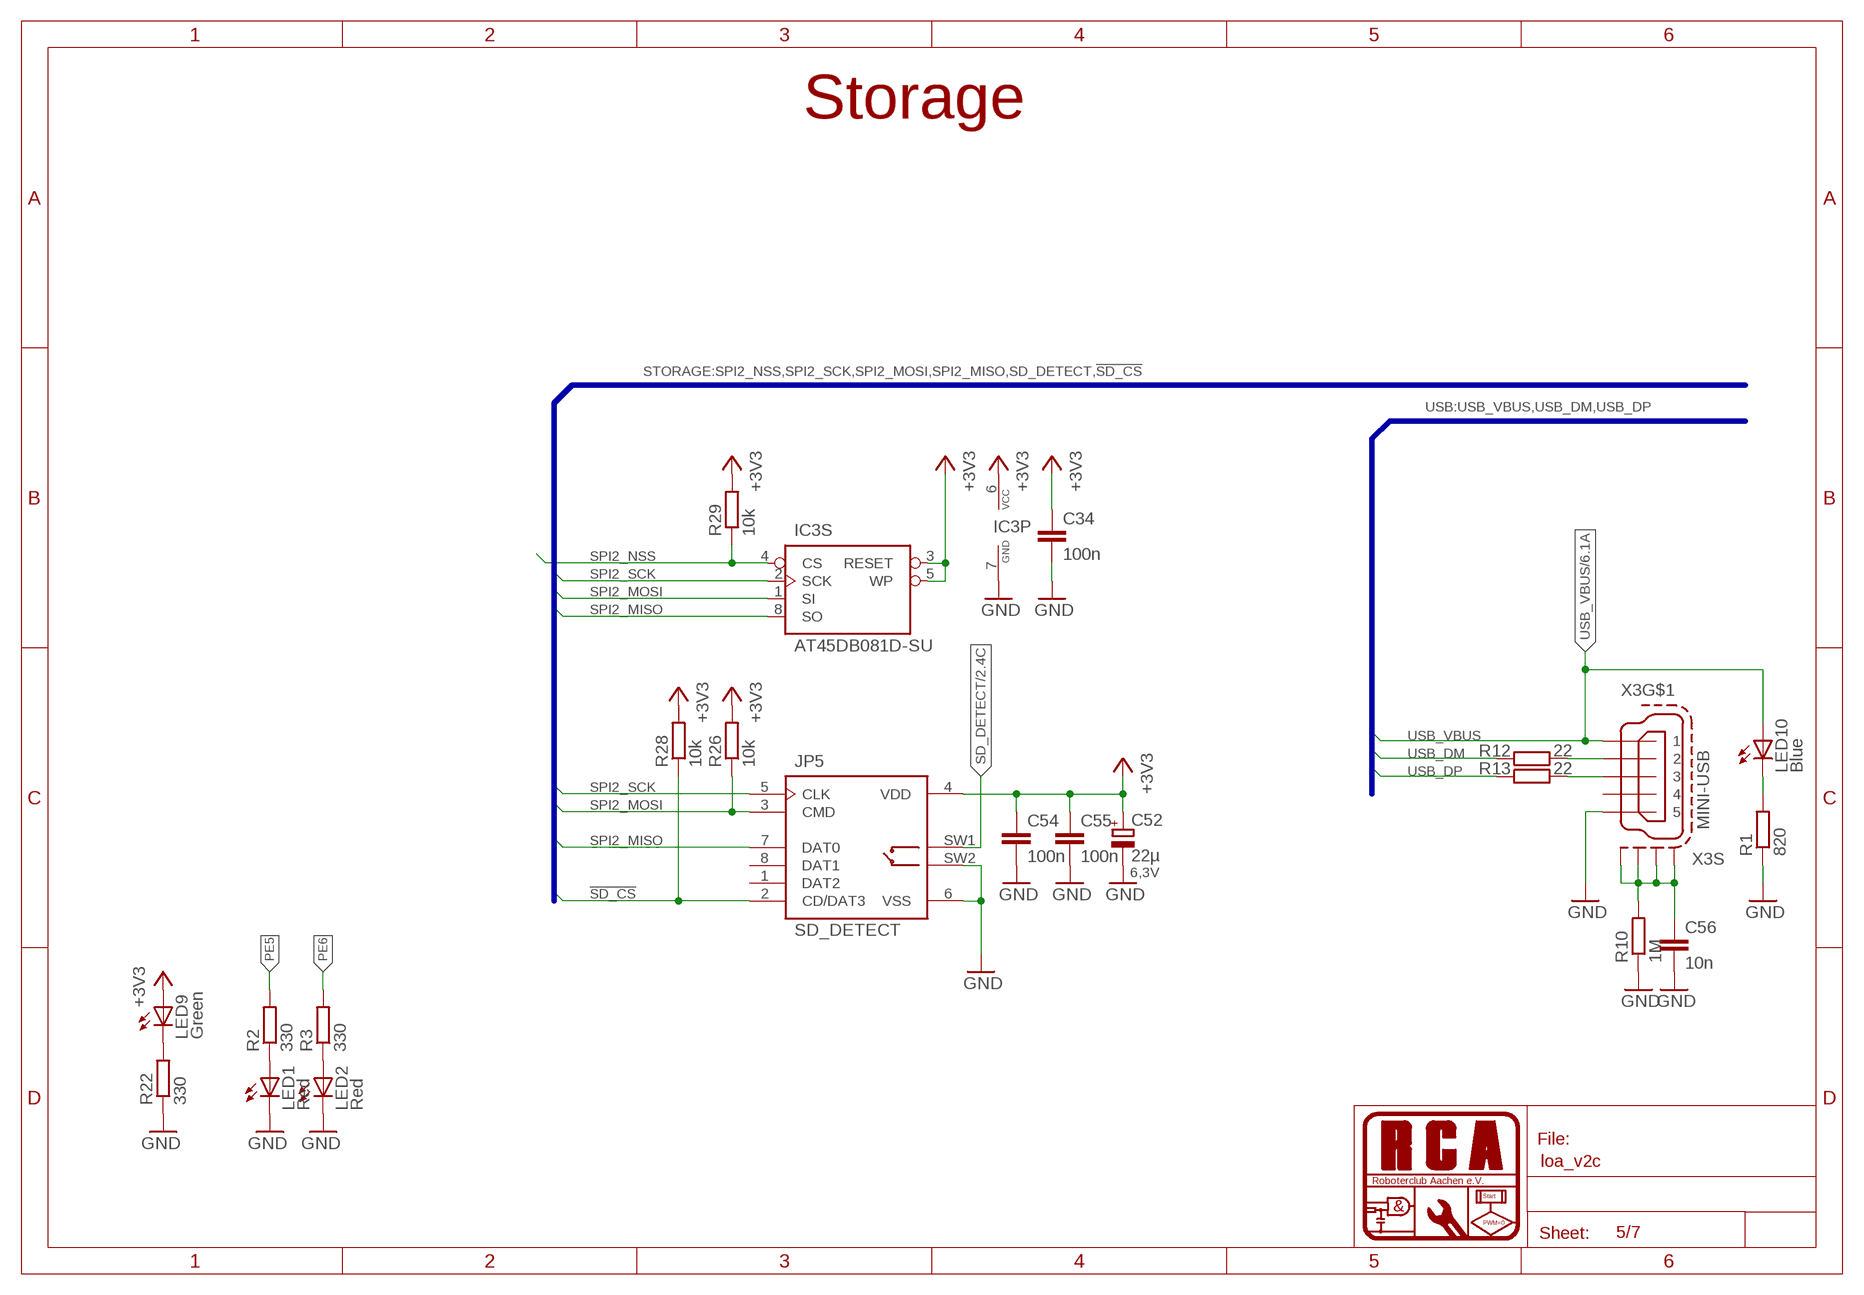
[diagram p4: schematic, sheet 5]

### Parts
C34  100n  C-EUC0603  [C0603]
C52  22µ  CPOL-EUSMCC  [SMC_C]
C54  100n  C-EUC0603  [C0603]
C55  100n  C-EUC0603  [C0603]
C56  10n  C-EUC0603  [C0603]
IC3  AT45DB081D-SU  AT45DB041DSS  [SO08]
JP5  SD_DETECT  [SD_MOLEX_49225-0821]
LED1  Red  LEDCHIPLED_0805  [CHIPLED_0805]
LED2  Red  LEDCHIPLED_0805  [CHIPLED_0805]
LED9  Green  LEDCHIPLED_0805  [CHIPLED_0805]
LED10  Blue  LEDCHIPLED_0805  [CHIPLED_0805]
R1  820  R-EU_R0805  [R0805]
R2  330  R-EU_R0603  [R0603]
R3  330  R-EU_R0603  [R0603]
R10  1M  R-EU_R0805  [R0805]
R12  22  R-EU_R0603  [R0603]
R13  22  R-EU_R0603  [R0603]
R22  330  R-EU_R0603  [R0603]
R26  10k  R-EU_R0603  [R0603]
R28  10k  R-EU_R0603  [R0603]
R29  10k  R-EU_R0603  [R0603]
X3  MINI-USB  MINI-USB-SCHIELD-32005-201  [32005-201]

### Nets
!SD_CS: JP5.2(CD/DAT3) R28.1 ; also sheet 2
+3V3: C34.1 C52.+ C54.1 C55.1 IC3.3(S:RESET) IC3.5(S:WP) IC3.6(P:VCC) JP5.4(VDD) LED9.A R26.2 R28.2 R29.2 ; also sheet 1,2,3,4,6,7
GND: C34.2 C52.- C54.2 C55.2 C56.2 IC3.7(P:GND) JP5.6(VSS) JP5.SW2 LED1.C LED2.C R1.1 R10.1 R22.1 X3.5 ; also sheet 1,2,3,4,6,7
N$1: LED1.A R2.1
N$16: R12.2 X3.2
N$17: R13.2 X3.3
N$18: LED2.A R3.1
N$26: LED9.C R22.2
N$33: LED10.C R1.2
N$42: C56.1 R10.2 X3.M1(S:S1) X3.M2(S:S2) X3.M3(S:S3) X3.M4(S:S4)
PE5: R2.2 ; also sheet 1,2
PE6: R3.2 ; also sheet 1,2
SD_DETECT: JP5.SW1 ; also sheet 2
SPI2_MISO: IC3.8(S:SO) JP5.7(DAT0) ; also sheet 2
SPI2_MOSI: IC3.1(S:SI) JP5.3(CMD) R26.1 ; also sheet 2
SPI2_NSS: IC3.4(S:CS) R29.1 ; also sheet 2
SPI2_SCK: IC3.2(S:SCK) JP5.5(CLK) ; also sheet 2
USB_DM: R12.1 ; also sheet 2
USB_DP: R13.1 ; also sheet 2
USB_VBUS: LED10.A X3.1 ; also sheet 2,6
Unconnected: JP5.1(DAT2) JP5.8(DAT1) X3.4

### Buses
USB:USB_VBUS,USB_DM,USB_DP
STORAGE:SPI2_NSS,SPI2_SCK,SPI2_MOSI,SPI2_MISO,SD_DETECT,!SD_CS

### Notes on the sheet
- Storage

## Sheet 6 of 7
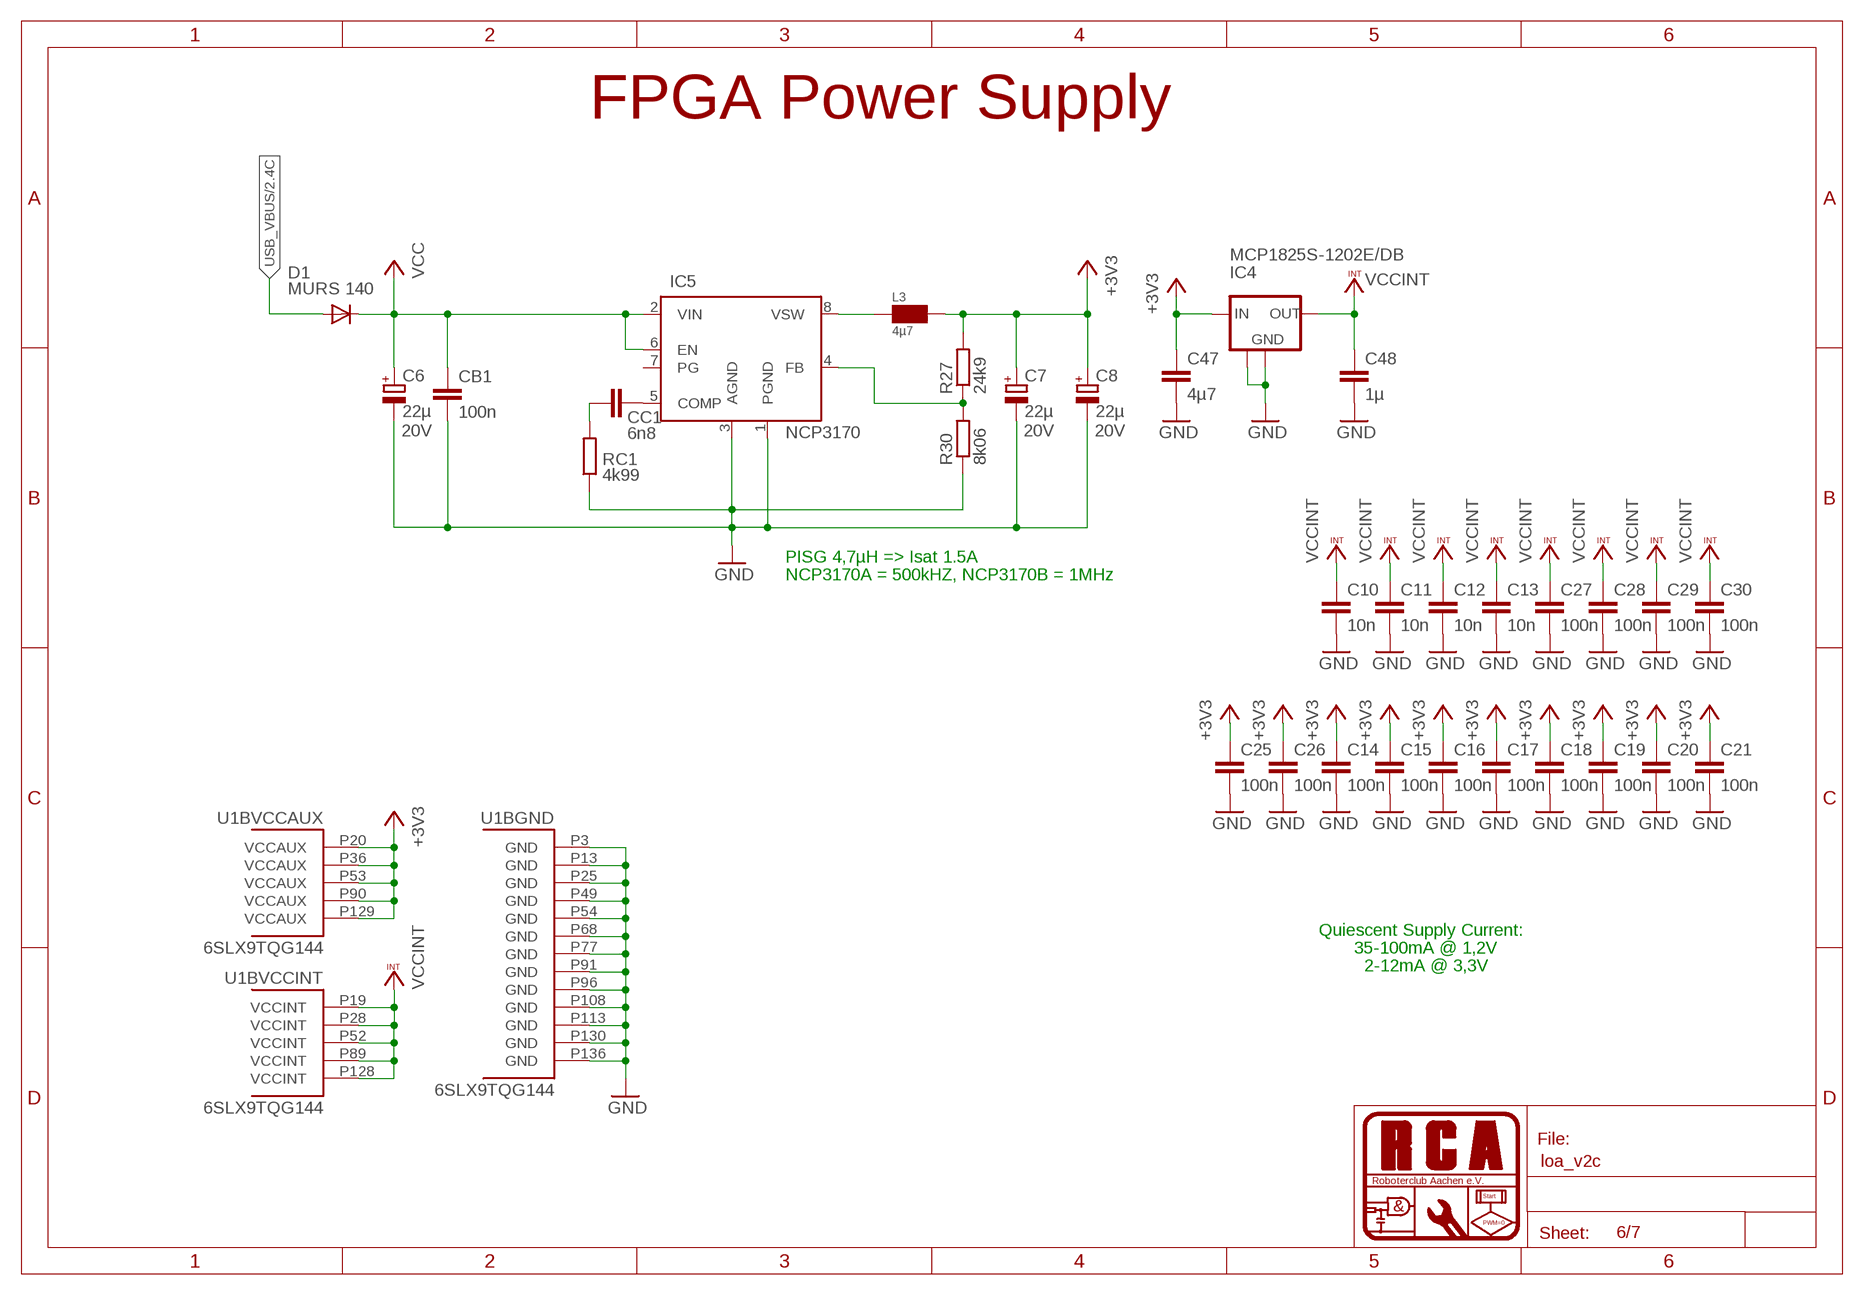
[diagram p5: schematic, sheet 6]

### Parts
C6  22µ  CPOL-EUSMCD  [SMC_D]
C7  22µ  CPOL-EUSMCC  [SMC_C]
C8  22µ  CPOL-EUSMCC  [SMC_C]
C10  10n  C-EUC0603  [C0603]
C11  10n  C-EUC0603  [C0603]
C12  10n  C-EUC0603  [C0603]
C13  10n  C-EUC0603  [C0603]
C14  100n  C-EUC0603  [C0603]
C15  100n  C-EUC0603  [C0603]
C16  100n  C-EUC0603  [C0603]
C17  100n  C-EUC0603  [C0603]
C18  100n  C-EUC0603  [C0603]
C19  100n  C-EUC0603  [C0603]
C20  100n  C-EUC0603  [C0603]
C21  100n  C-EUC0603  [C0603]
C25  100n  C-EUC0603  [C0603]
C26  100n  C-EUC0603  [C0603]
C27  100n  C-EUC0603  [C0603]
C28  100n  C-EUC0603  [C0603]
C29  100n  C-EUC0603  [C0603]
C30  100n  C-EUC0603  [C0603]
C47  4µ7  C-EUC0805  [C0805]
C48  1µ  C-EUC0805  [C0805]
CB1  100n  C-EUC0603  [C0603]
CC1  6n8  C-EUC0805  [C0805]
D1  MURS 140  DIODE-SMB  [SMB]
IC4  MCP1825S-1202E/DB  MCP1825DB  [SOT223]
IC5  NCP3170  [SO08]
L3  4µ7  INDUCTOR-PISG  [L-PISG]
R27  24k9  R-EU_M0805  [M0805]
R30  8k06  R-EU_M0805  [M0805]
RC1  4k99  R-EU_M0805  [M0805]

### Nets
+3V3: C7.+ C8.+ C14.1 C15.1 C16.1 C17.1 C18.1 C19.1 C20.1 C21.1 C25.1 C26.1 C47.1 IC4.1(IN) L3.2 R27.2 U1.P20(BVCCAUX:VCCAUX) U1.P36(BVCCAUX:VCCAUX) U1.P53(BVCCAUX:VCCAUX) U1.P90(BVCCAUX:VCCAUX) U1.P129(BVCCAUX:VCCAUX) ; also sheet 1,2,3,4,5,7
GND: C6.- C7.- C8.- C10.2 C11.2 C12.2 C13.2 C14.2 C15.2 C16.2 C17.2 C18.2 C19.2 C20.2 C21.2 C25.2 C26.2 C27.2 C28.2 C29.2 C30.2 C47.2 C48.2 CB1.2 IC4.2(GND) IC4.4(GND) IC5.1(PGND) IC5.3(AGND) R30.1 RC1.1 U1.P3(BGND:GND) U1.P13(BGND:GND) U1.P25(BGND:GND) U1.P49(BGND:GND) U1.P54(BGND:GND) U1.P68(BGND:GND) U1.P77(BGND:GND) U1.P91(BGND:GND) U1.P96(BGND:GND) U1.P108(BGND:GND) U1.P113(BGND:GND) U1.P130(BGND:GND) U1.P136(BGND:GND) ; also sheet 1,2,3,4,5,7
N$51: CC1.2 RC1.2
N$52: CC1.1 IC5.5(COMP)
N$53: IC5.8(VSW) L3.1
N$54: IC5.4(FB) R27.1 R30.2
USB_VBUS: D1.A ; also sheet 2,5
VCC: C6.+ CB1.1 D1.C IC5.2(VIN) IC5.6(EN) ; also sheet 1
VCCINT: C10.1 C11.1 C12.1 C13.1 C27.1 C28.1 C29.1 C30.1 C48.1 IC4.3(OUT) U1.P19(BVCCINT:VCCINT) U1.P28(BVCCINT:VCCINT) U1.P52(BVCCINT:VCCINT) U1.P89(BVCCINT:VCCINT) U1.P128(BVCCINT:VCCINT)
Unconnected: IC5.7(PG)

### Notes on the sheet
- FPGA Power Supply
- PISG 4,7µH => Isat 1.5A
- NCP3170A = 500kHZ, NCP3170B = 1MHz
- Quiescent Supply Current:
- 35-100mA @ 1,2V
- 2-12mA @ 3,3V

## Sheet 7 of 7
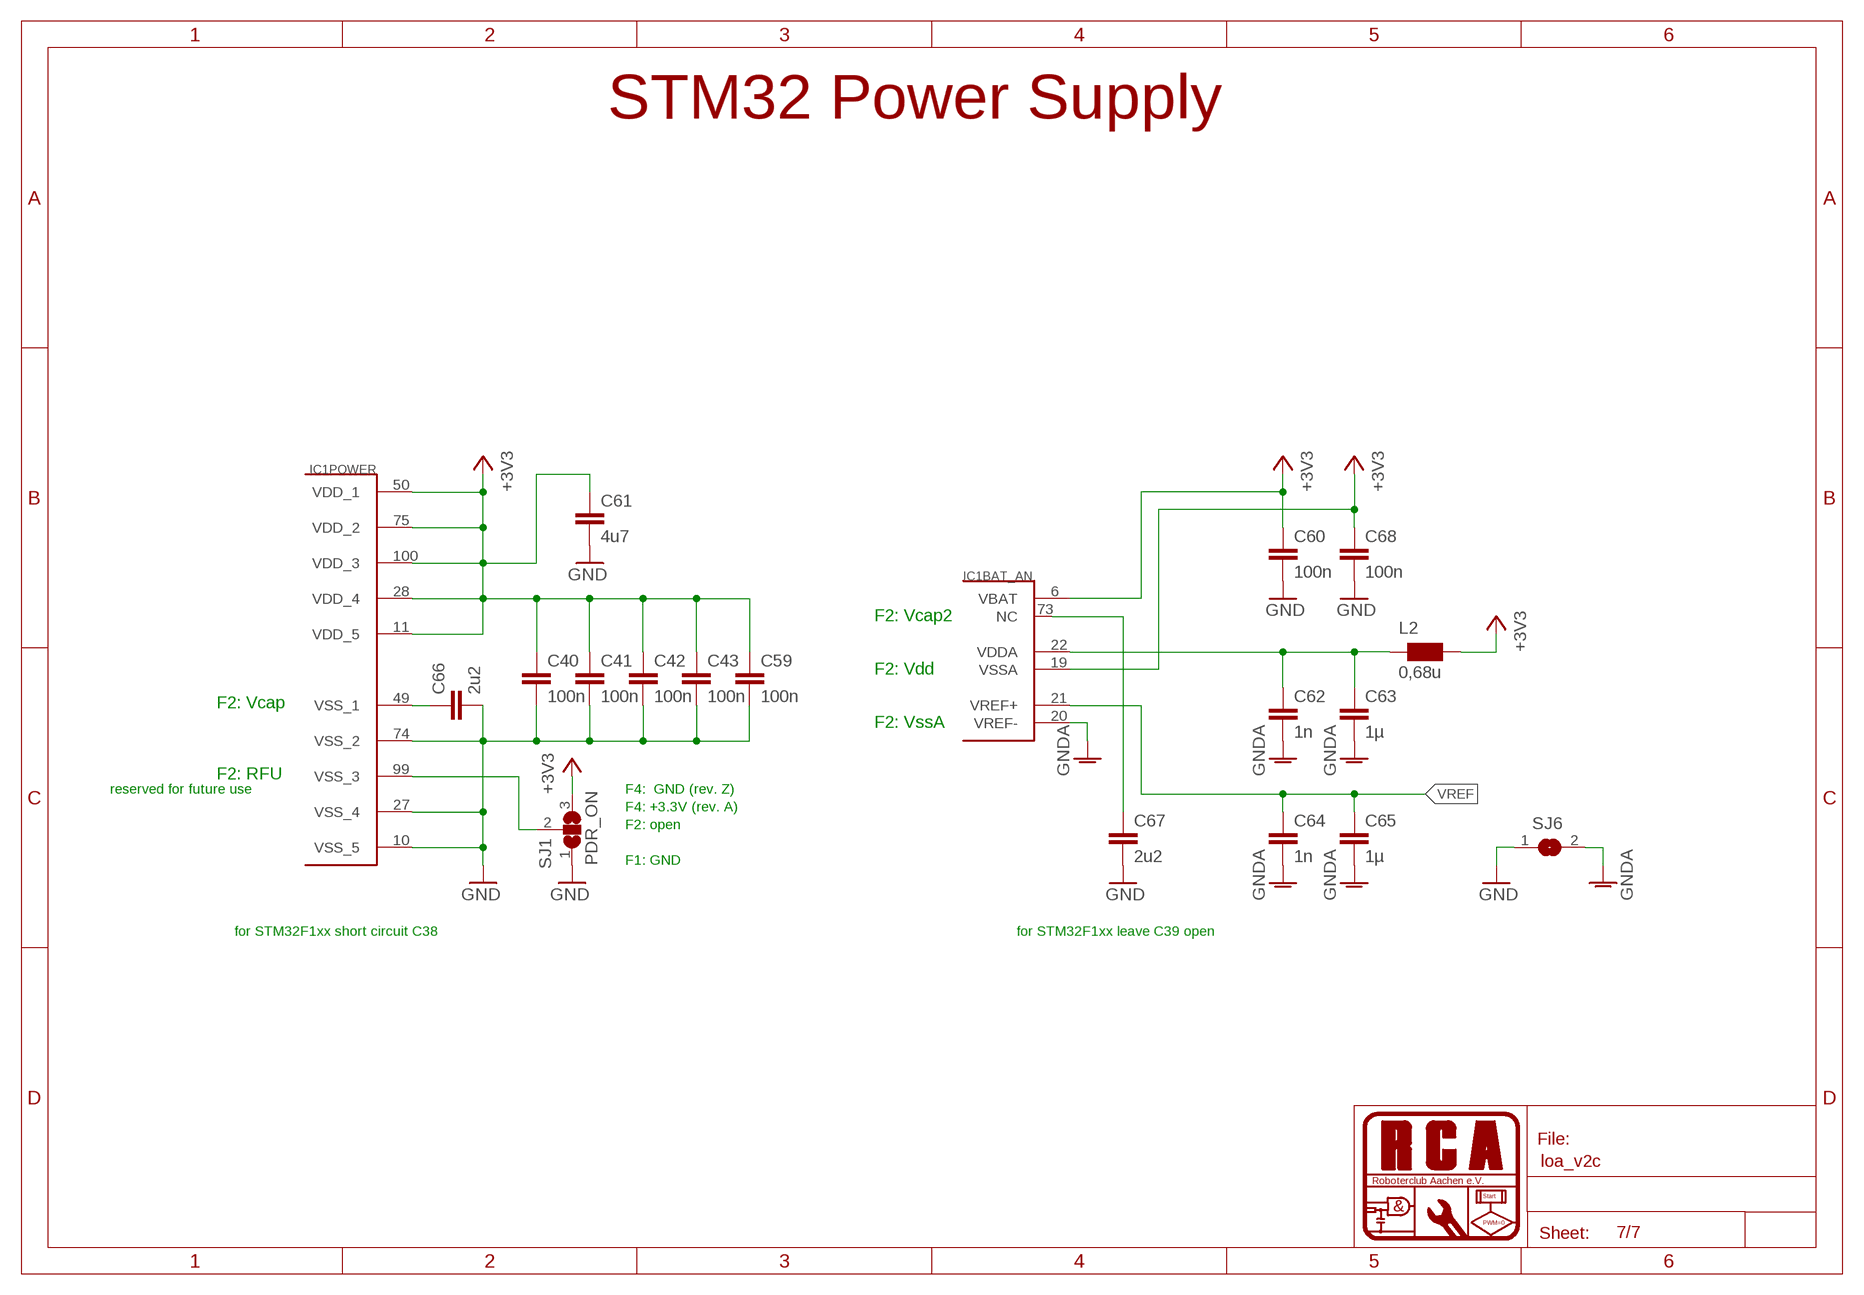
[diagram p6: schematic, sheet 7]

### Parts
C40  100n  C-EUC0603  [C0603]
C41  100n  C-EUC0603  [C0603]
C42  100n  C-EUC0603  [C0603]
C43  100n  C-EUC0603  [C0603]
C59  100n  C-EUC0603  [C0603]
C60  100n  C-EUC0603  [C0603]
C61  4u7  C-EUC0805  [C0805]
C62  1n  C-EUC0603  [C0603]
C63  1µ  C-EUC0805  [C0805]
C64  1n  C-EUC0603  [C0603]
C65  1µ  C-EUC0805  [C0805]
C66  2u2  C-EUC0805  [C0805]
C67  2u2  C-EUC0805  [C0805]
C68  100n  C-EUC0603  [C0603]
L2  0,68u  WE-KIHQ_0805  [WE-KI_0805_B]
SJ1  PDR_ON  SJ2WS  [SJ_2S]
SJ6  SJS  [SJS]

### Nets
+3V3: C40.1 C41.1 C42.1 C43.1 C59.1 C60.1 C61.1 C68.1 IC1.6(BAT_AN:VBAT) IC1.11(POWER:VDD_5) IC1.19(BAT_AN:VSSA) IC1.28(POWER:VDD_4) IC1.50(POWER:VDD_1) IC1.75(POWER:VDD_2) IC1.100(POWER:VDD_3) L2.1 SJ1.3 ; also sheet 1,2,3,4,5,6
GND: C40.2 C41.2 C42.2 C43.2 C59.2 C60.2 C61.2 C66.2 C67.2 C68.2 IC1.10(POWER:VSS_5) IC1.27(POWER:VSS_4) IC1.74(POWER:VSS_2) SJ1.1 SJ6.1 ; also sheet 1,2,3,4,5,6
GNDA: C62.2 C63.2 C64.2 C65.2 IC1.20(BAT_AN:VREF-) SJ6.2 ; also sheet 1
N$4: IC1.99(POWER:VSS_3) SJ1.2
N$37: C62.1 C63.1 IC1.22(BAT_AN:VDDA) L2.2
N$38: C66.1 IC1.49(POWER:VSS_1)
N$39: C67.1 IC1.73(BAT_AN:NC)
VREF: C64.1 C65.1 IC1.21(BAT_AN:VREF+) ; also sheet 1

### Notes on the sheet
- STM32 Power Supply
- F2: Vcap2
- F2: Vdd
- F2: Vcap
- F2: VssA
- F2: RFU
- reserved for future use | F4:  GND (rev. Z)
- F4: +3.3V (rev. A)
- F2: open
- F1: GND
- for STM32F1xx short circuit C38 | for STM32F1xx leave C39 open

## Library data of the parts
C6-C8 = rcl:CPOL-EU: POLARIZED CAPACITOR, European symbol; VOLTAGE: 20V
C9-C21 C23-C30 C34 C40-C43 C45-C48 C54-C68 CB1 CC1 = rcl:C-EU: CAPACITOR, European symbol
C52 = rcl:CPOL-EU: POLARIZED CAPACITOR, European symbol; VOLTAGE: 6,3V
D1 = diode:DIODE-: DIODE
IC1 = stm32:STM32F10XVXT6: STM32F101/103 100 pin LQFP
IC3 = rca_ic:AT45DB: AT45DBxxxD Single 2.5V or 2.7V to 3.6V Supply Serial Interface: 66 MHz Maximum Clock Frequency AT45DB041D: 4,325,376 bits of memory as 2,048 pages of 256 bytes
IC4 = rca_spgversorgung:MCP182*
IC5 = rca_spgversorgung:NCP3170: Synchronous PWM Switching Converter The NCP3170 is a flexible synchronous PWM Switching Buck Regulator. The NCP3170 operates from 4.5V to 18V, sourcing up to 3A and is capable of producing output voltages as low as 0.8V. The NCP3170 also incorporates current mode control. To reduce the number of external components, a number of features are internally set including soft start, power good detection, and switching frequency. The NCP3170 is currently available in an SOIC-8 package.
IC6 = rca_ic:AD726*: AD7266/5 Differential/Single-Ended Input, Dual 2 MSPS, 12-Bit, 3-Channel SAR ADC Dual 12-bit, 3-channel ADC Throughput rate: 2 MSPS Specified for VDD of 2.7 V to 5.25 V Power consumption 9 mW at 1.5 MSPS with 3 V supplies 27 mW at 2 MSPS with 5 V supplies Pin-configurable analog inputs 12-channel single-ended inputs 6-channel fully differential inputs 6-channel pseudo differential inputs 70 dB SNR at 50 kHz input frequency Accurate on-chip reference: 2.5 V ±0.2% maximum @ 25°C, 20 ppm/°C maximum Dual conversion with read 437.5 ns, 32 MHz SCLK High speed serial interface SPI®-/QSPITM-/MICROWIRETM-/DSP-compatible ?40°C to +125°C operation Shutdown mode: 1 ?A maximum 1 MSPS version, AD7265
JP2 = rca_stecker:CORTEX_JTAG
JP3 = rca_stecker:ML10
JP5 = rca_stecker:SD_DETECT
JP7 JP8 = pinhead2:PINHD-2X32
L2 L4 = wuerth-elektronik:WE-KIHQ: SMD Wire Wound Ceramic Inductor WE-KIHQ - High current - Highest Quality factor in size 0805 - up to 98 - High thermal stability - High SRF -- Bluetooth -- Wireless LAN -- RF oscillation circuit -- IF impedance matching -- IG choke
L3 = rca_sontiges:INDUCTOR: SMD-Power-Induktivitäten z.B. PISM, Ferrit, 150µ, Reichelt Bestellnr.: L-PISM 150µ
LED1 LED2 LED9 LED10 = led:LED: LED OSRAM: - CHIPLED LG R971, LG N971, LY N971, LG Q971, LY Q971, LO R971, LY R971 LH N974, LH R974 LS Q976, LO Q976, LY Q976 LO Q996 - Hyper CHIPLED LW Q18S LB Q993, LB Q99A, LB R99A - SideLED LS A670, LO A670, LY A670, LG A670, LP A670 LB A673, LV A673, LT A673, LW A673 LH A674 LY A675 LS A676, LA A676, LO A676, LY A676, LW A676 LS A679, LY A679, LG A679 - Hyper Micro SIDELED® LS Y876, LA Y876, LO Y876, LY Y876 LT Y87S - SmartLED LW L88C, LW L88S LB L89C, LB L89S, LG L890 LS L89K, LO L89K, LY L89K LS L896, LA L896, LO L896, LY L896 - TOPLED LS T670, LO T670, LY T670, LG T670, LP T670 LSG T670, LSP T670, LSY T670, LOP T670, LYG T670 LG T671, LOG T671, LSG T671 LB T673, LV T673, LT T673, LW T673 LH T674 LS T676, LA T676, LO T676, LY T676, LB T676, LH T676, LSB T676, LW T676 LB T67C, LV T67C, LT T67C, LS T67K, LO T67K, LY T67K, LW E67C LS E67B, LA E67B, LO E67B, LY E67B, LB E67C, LV E67C, LT E67C LW T67C LS T679, LY T679, LG T679 LS T770, LO T770, LY T770, LG T770, LP T770 LB T773, LV T773, LT T773, LW T773 LH T774 LS E675, LA E675, LY E675, LS T675 LS T776, LA T776, LO T776, LY T776, LB T776 LHGB T686 LT T68C, LB T68C - Hyper Mini TOPLED® LB M676 - Mini TOPLED Santana® LG M470 LS M47K, LO M47K, LY M47K Source: http://www.osram.convergy.de LUXEON: - LUMILED® LXK2-PW12-R00, LXK2-PW12-S00, LXK2-PW14-U00, LXK2-PW14-V00 LXK2-PM12-R00, LXK2-PM12-S00, LXK2-PM14-U00 LXK2-PE12-Q00, LXK2-PE12-R00, LXK2-PE12-S00, LXK2-PE14-T00, LXK2-PE14-U00 LXK2-PB12-K00, LXK2-PB12-L00, LXK2-PB12-M00, LXK2-PB14-N00, LXK2-PB14-P00, LXK2-PB14-Q00 LXK2-PR12-L00, LXK2-PR12-M00, LXK2-PR14-Q00, LXK2-PR14-R00 LXK2-PD12-Q00, LXK2-PD12-R00, LXK2-PD12-S00 LXK2-PH12-R00, LXK2-PH12-S00 LXK2-PL12-P00, LXK2-PL12-Q00, LXK2-PL12-R00 Source: www.luxeon.com KINGBRIGHT: KA-3528ASYC Source: www.kingbright.com
Q2 Q3 = rca_sontiges:XO: XO91 Series Oscillators Frequency Range 500 kHz to 125 MHz Supply voltage range 1.8, 2.5, 3.3 or 5.0 Volts Gibt es in der 3,3V Version bei Reichelt (XO91 #Wert) Datenblatt: http://www.reichelt.de/?;ACTION=7;LA=6;OPEN=0;INDEX=0;FILENAME=B400%252FXO91.pdf XO53 Series Oscillators Frequency Range 2.5 MHz to 125 MHz Supply voltage range 1.8, 2.5, 3.3 Volts Gibt es in der 3,3V Version bei Reichelt (XO53 #Wert)
R1-R4 R7 R9-R15 R22 R26-R30 R32 RC1 = rcl:R-EU_: RESISTOR, European symbol
RN3 RN4 RN6 RN7 = resistor-dil:4R-N: Array Chip Resistor Source: RS Component / Phycomp; OC_FARNELL: unknown; OC_NEWARK: unknown
S2 = rca_sontiges:10-XX*: OMRON SWITCH
SJ1 = rca_sontiges:SJ2W: SMD solder JUMPER
SJ6 = rca_sontiges:SJ: SMD solder JUMPER
U1 = xilinx_devices:6SLX9TQG144: Xilinx FPGA: 6SLX9TQG144
X3 = con-cypressindustries:MINI-USB-SCHIELD-: MINI USB-B Conector Source: www.cypressindustries.com